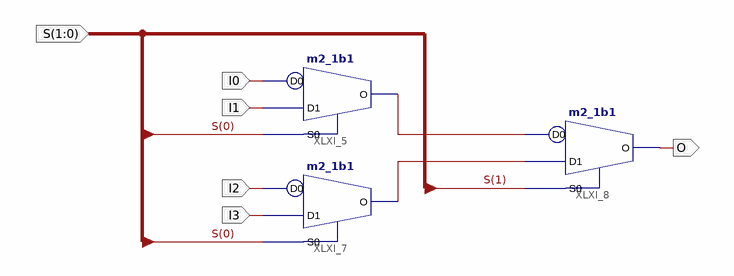
[diagram p0: schematic sheet 1]
// Xilinx ISE schematic Mux4to1.sch (kintex7) as structural Verilog: 3 symbols, 6 ports
module Mux4to1 (
  input  [1:0] S,
  input  I0,
  input  I1,
  input  I2,
  input  I3,
  output O
);

  wire XLXN_19, XLXN_20;

  m2_1b1 XLXI_5 (.D0(I0), .D1(I1), .S0(S[0]), .O(XLXN_19));
  m2_1b1 XLXI_7 (.D0(I2), .D1(I3), .S0(S[0]), .O(XLXN_20));
  m2_1b1 XLXI_8 (.D0(XLXN_19), .D1(XLXN_20), .S0(S[1]), .O(O));
endmodule
